# EAGLE board STUSB4500_PS (EAGLE 9.5.2), part 1 of 2
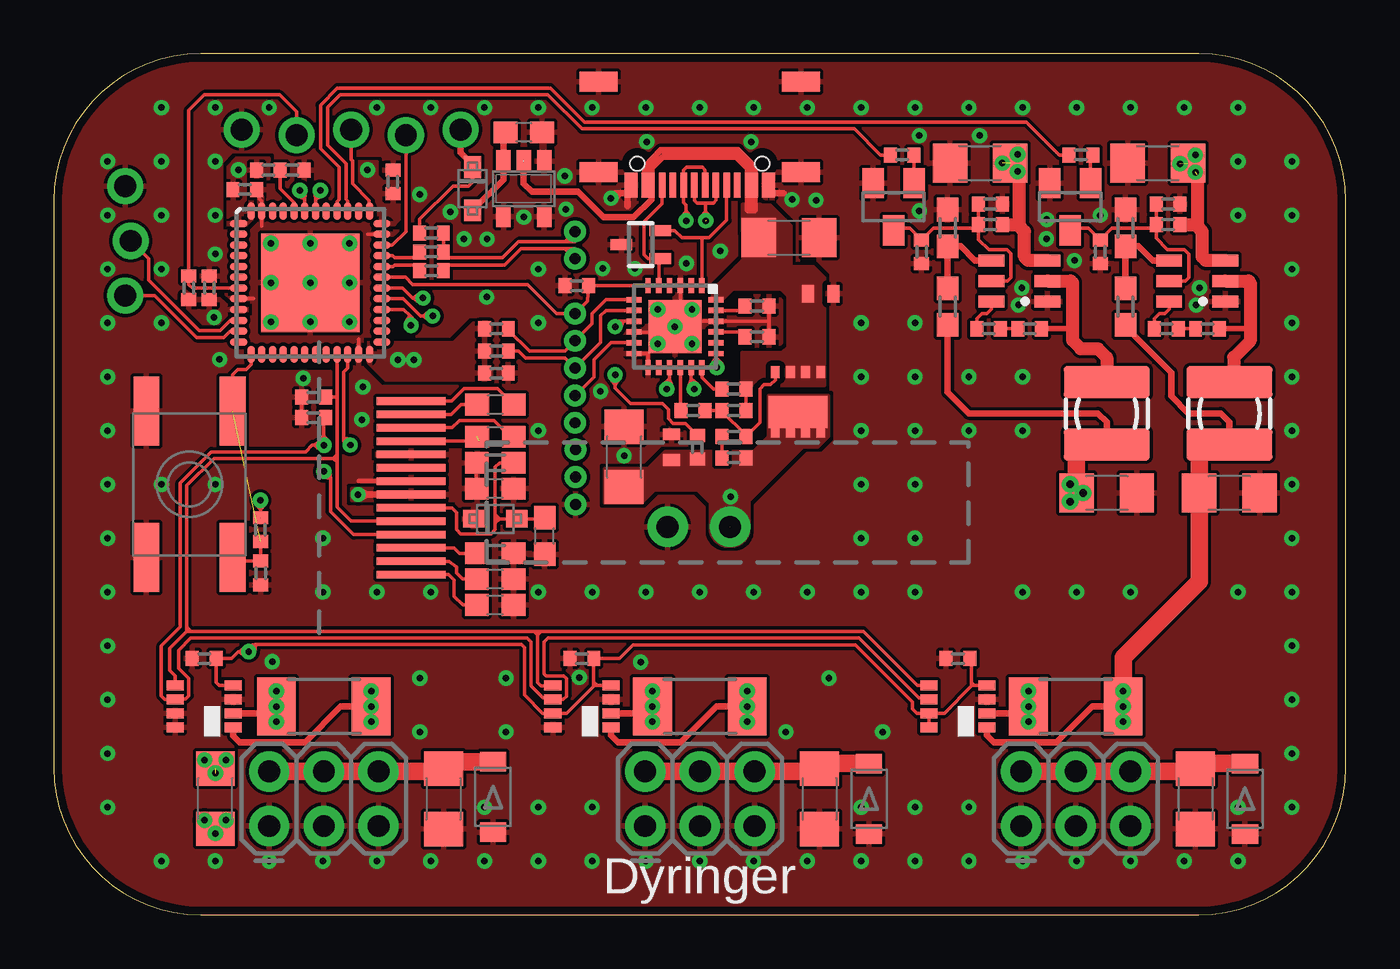
[diagram p4: board, top side]
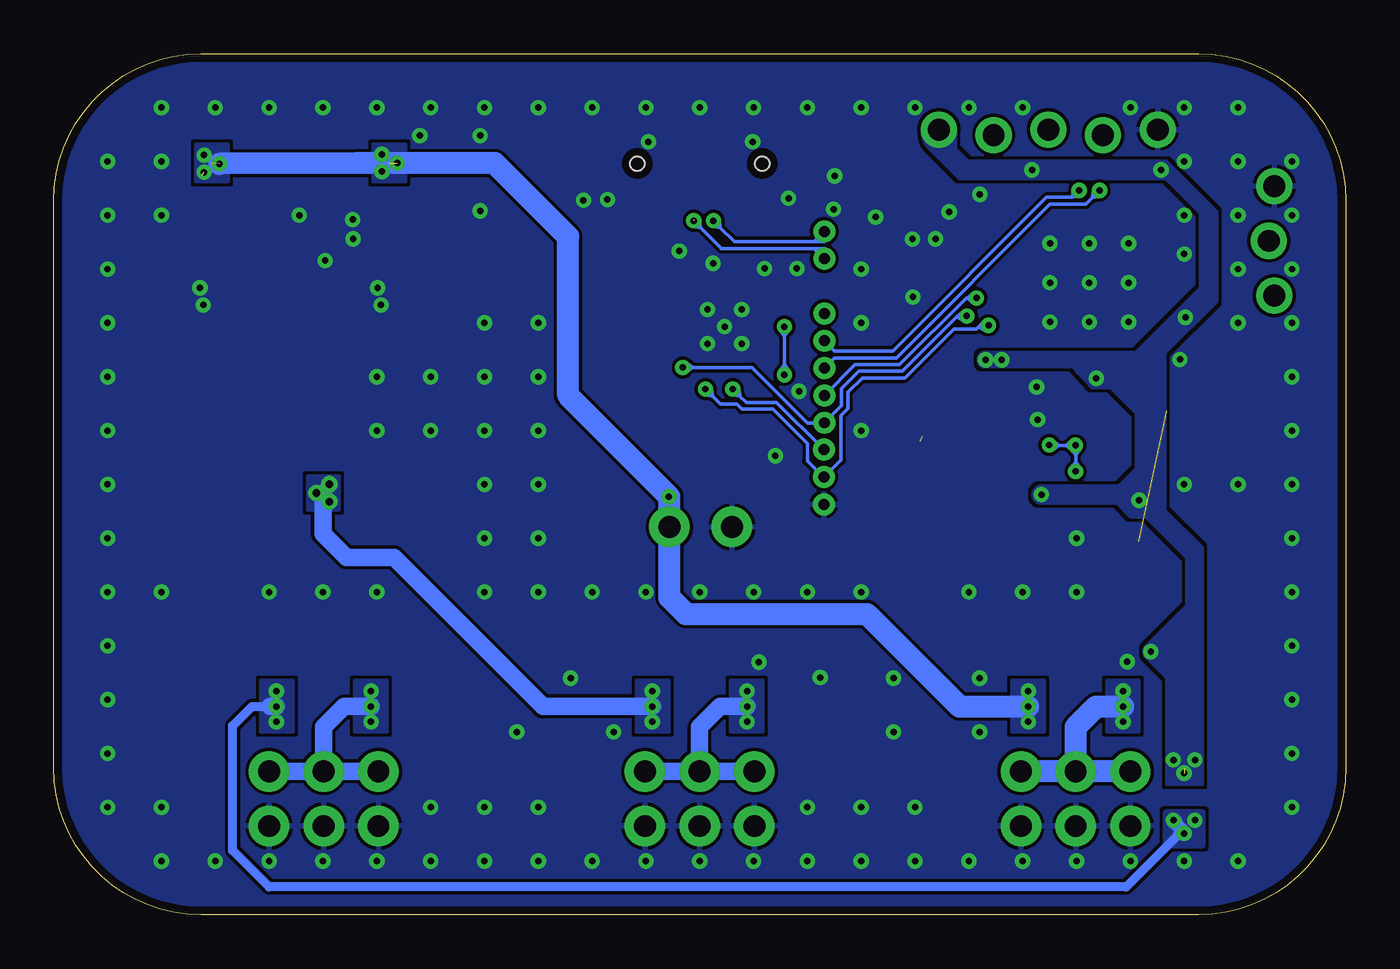
[diagram p5: board, bottom side, seen from below]

Size 60 x 40 mm. Coordinates in mm from the lower left corner, seen from the top.
Outline: 0,33.17 0,6.83 arc90 6.83,0 53.17,0 arc90 60,6.83 60,33.17 arc90 53.17,40 6.83,40 arc90 0,33.17
Copper layers (1*16): Top 0.035mm / dielectric 0.15mm / Bottom 0.035mm
Design rules "default *": minimum track width 6mil, minimum drill 0.3mm, track to track 6mil, track to pad 6mil, pad to pad 6mil, via to via 6mil, smd to smd 6mil, copper to edge 15mil, drill to drill 6mil, minimum pad ring 10mil, minimum via ring 8mil, stop-mask expansion 3mil, vias tented up to drill 20mil, thermal gap 6mil

## Footprints (pad centres in the part's own frame; a part is rotated, then mirrored left to right if it is on the bottom)
C0603 = smd 1.1 x 1: 1 -0.85,0; 2 0.85,0
C0402 = smd 0.6 x 0.7: 1 -0.55,0; 2 0.55,0
C1206 = smd 1.6 x 1.8: 1 -1.4,0; 2 1.4,0
SOD-123FL = smd 0.91 x 1.22: A 1.637,0; C -1.637,0
SOD-323F = smd 1 x 0.8: A -1,0; C 1,0
SOT323 = smd 0.5 x 1: 1 0,0.9; 2 -0.65,-0.9; 3 0.65,-0.9
1206 = smd 1.6 x 1.8: 1 -1.4,0; 2 1.4,0
1X05_LOCK = drill 1.016 pad 1.676: 1 0,0.127; 2 2.54,-0.127; 3 5.08,0.127; 4 7.62,-0.127; 5 10.16,0.127
2X3-NS = drill 1.016 pad 1.88: 1 -2.54,-1.27; 2 -2.54,1.27; 3 0,-1.27; 4 0,1.27; 5 2.54,-1.27; 6 2.54,1.27
1X03_LOCK_NO_SILK = drill 1.016 pad 1.676: 1 0,0.127; 2 2.54,-0.127; 3 5.08,0.127
1X02_LOCK = drill 1.016 pad 1.88: 1 -0.178,0; 2 2.718,0
1X05_1.27MM = drill 0.508 pad 1: 1 0,0; 2 1.27,0; 3 2.54,0; 4 3.81,0; 5 5.08,0
1X02_1.27MM = drill 0.508 pad 1: 1 0,0; 2 1.27,0
1X03_1.27MM = drill 0.508 pad 1: 1 0,0; 2 1.27,0; 3 2.54,0
POWER-CHOKE_WE-TPC = smd 4 x 1.5: 1 0,1.45; 2 0,-1.45
UG-2832HSWEG02_WRAPUNDER = smd 3.2 x 0.35: 1 2.03,4.03; 2 2.03,3.41; 3 2.03,2.79; 4 2.03,2.17; 5 2.03,1.55; 6 2.03,0.93; 7 2.03,0.31; 8 2.03,-0.31; 9 2.03,-0.93; 10 2.03,-1.55; 11 2.03,-2.17; 12 2.03,-2.79; 13 2.03,-3.41; 14 2.03,-4.03
R0402 = smd 0.6 x 0.7: 1 -0.55,0; 2 0.55,0
R2010 = smd 1.8 x 2.7: 1 -2.2,0; 2 2.2,0
R0603 = smd 1.1 x 1: 1 -0.85,0; 2 0.85,0
EVQ-Q2 = smd 3.2 x 1.2: A -3.4,-2; A' 3.4,-2; B -3.4,2; B' 3.4,2
SOT23 = smd 1 x 1.4: 1 -0.95,-1.1; 2 0.95,-1.1; 3 0,1.1
SOT23-5 = smd 0.69 x 0.99: 1 -0.95,-1.29; 2 0,-1.29; 3 0.95,-1.29; 4 0.95,1.3; 5 -0.95,1.3
QFN24-4X4 = smd 0.7 x 0.25: 1 -1.9,1.25; 2 -1.9,0.75; 3 -1.9,0.25; 4 -1.9,-0.25; 5 -1.9,-0.75; 6 -1.9,-1.25; 13 1.9,-1.25; 14 1.9,-0.75; 15 1.9,-0.25; 16 1.9,0.25; 17 1.9,0.75; 18 1.9,1.25 | smd 0.25 x 0.7: 7 -1.25,-1.9; 8 -0.75,-1.9; 9 -0.25,-1.9; 10 0.25,-1.9; 11 0.75,-1.9; 12 1.25,-1.9; 19 1.25,1.9; 20 0.75,1.9; 21 0.25,1.9; 22 -0.25,1.9; 23 -0.75,1.9; 24 -1.25,1.9 | smd 2.45 x 2.45: EXP 0,0
DCN-R-PDSO-G8 = smd 0.45 x 0.8: 1 -0.975,-1.35; 2 -0.325,-1.35; 3 0.325,-1.35; 4 0.975,-1.35; 5 0.975,1.35; 6 0.325,1.35; 7 -0.325,1.35; 8 -0.975,1.35
P-HVQFN48-7X7 = smd 0.8 x 0.35: 1 -3.325,2.75; 2 -3.325,2.25; 3 -3.325,1.75; 4 -3.325,1.25; 5 -3.325,0.75; 6 -3.325,0.25; 7 -3.325,-0.25; 8 -3.325,-0.75; 9 -3.325,-1.25; 10 -3.325,-1.75; 11 -3.325,-2.25; 12 -3.325,-2.75; 25 3.325,-2.75; 26 3.325,-2.25; 27 3.325,-1.75; 28 3.325,-1.25; 29 3.325,-0.75; 30 3.325,-0.25; 31 3.325,0.25; 32 3.325,0.75; 33 3.325,1.25; 34 3.325,1.75; 35 3.325,2.25; 36 3.325,2.75 | smd 0.35 x 0.8: 13 -2.75,-3.325; 14 -2.25,-3.325; 15 -1.75,-3.325; 16 -1.25,-3.325; 17 -0.75,-3.325; 18 -0.25,-3.325; 19 0.25,-3.325; 20 0.75,-3.325; 21 1.25,-3.325; 22 1.75,-3.325; 23 2.25,-3.325; 24 2.75,-3.325; 37 2.75,3.325; 38 2.25,3.325; 39 1.75,3.325; 40 1.25,3.325; 41 0.75,3.325; 42 0.25,3.325; 43 -0.25,3.325; 44 -0.75,3.325; 45 -1.25,3.325; 46 -1.75,3.325; 47 -2.25,3.325; 48 -2.75,3.325 | smd 4.572 x 4.572: _ 0,0
TEXAS_SOT23-6 = smd 0.55 x 1.2: 1 -0.95,-1.3; 2 0,-1.3; 3 0.95,-1.3; 4 0.95,1.3; 5 0,1.3; 6 -0.95,1.3
USB-C_16P = smd 0.3 x 1.15: A1 -3.35,0.6; A4 -2.55,0.6; A5 -1.25,0.6; A6 -0.25,0.6; A7 0.25,0.6; A8 1.25,0.6; A9 2.55,0.6; A12 3.35,0.6; B1 3.05,0.6; B4 2.25,0.6; B5 1.75,0.6; B6 0.75,0.6; B7 -0.75,0.6; B8 -1.75,0.6; B9 -2.25,0.6; B12 -3.05,0.6 | smd 1.778 x 0.914: P$1 -4.7,-4.2; P$2 -4.7,0; P$3 4.7,0; P$4 4.7,-4.2 | hole 0.65: -2.9,-0.4; 2.9,-0.4
1610 = smd 0.55 x 0.8: P$1 0.596,0; P$2 -0.596,0
POWER_FLAT_3X3 = smd 0.4 x 0.55: P$1 -1.05,-0.95; P$2 -0.35,-0.95; P$3 0.35,-0.95; P$4 1.05,-0.95; P$5 -1.05,1.8; P$6 -0.35,1.8; P$7 0.35,1.8; P$8 1.05,1.8 | smd 2.75 x 1.47: P$9 0,0.9

## Placement (x,y rotation side)
C1  10uF 6.3V  [C0603]  21.83,36.35 180 top
C2  100nF 25V  [C0402]  40.3,30.8 90 top
C3  100nF 25V  [C0402]  48.6,30.8 90 top
C4  10uF 6.3V  [C0603]  22.8,17.6 90 top
C6  100nF 25V  [C0402]  24.53,11.91 180 top
C7  100nF 25V  [C0402]  41.99,11.91 180 top
C8  100nF 25V  [C0402]  6.99,11.91 180 top
C9  100nF 25V  [C0402]  45.32,27.23 0 top
C10  22uF 6.3V  [C1206]  48.9,19.6 180 top
C11  10uF 25V  [C1206]  43.02,34.92 0 top
C12  100nF 25V  [C0402]  53.58,27.23 0 top
C13  22uF 6.3V  [C1206]  54.6,19.6 180 top
C14  10uF 25V  [C1206]  51.28,34.92 0 top
C15  100nF 25V  [C0402]  8.87,33.69 0 top
C16  100nF 25V  [C0402]  15.75,34.05 90 top
C17  100nF 25V  [C0402]  20.56,25.16 0 top
C18  100nF 25V  [C0402]  9.61,15.88 90 top
C19  100nF 25V  [C0402]  7.22,29.13 90 top
C20  10uF 6.3V  [C0603]  20.5,14.4 180 top
C21  10uF 6.3V  [C0603]  20.5,15.6 180 top
C22  1uF 25V  [C0603]  20.5,19.8 180 top
C23  1uF 25V  [C0603]  20.51,22.22 0 top
C24  1uF 25V  [C0603]  20.51,23.71 0 top
C25  22uF 6.3V  [C1206]  35.56,5.4 270 top
C26  22uF 6.3V  [C1206]  53.02,5.4 270 top
C27  10uF 25V  [C1206]  18.1,5.4 270 top
C28  1uF 6.3V  [C0402]  32.66,28.28 0 top
C29  1uF 6.3V  [C0402]  32.66,26.85 0 top
C30  100nF 25V  [C0402]  31.59,21.23 0 top
C31  10uF 25V  [C1206]  34.14,31.46 0 top
C32  10uF 25V  [C1206]  26.49,21.28 90 top
D1  [SOD-123FL]  20.4,5.48 270 top
D2  1N4148  [SOD-323F]  20.5,18.4 180 top
D3  [SOD-123FL]  55.32,5.4 270 top
D4  [SOD-123FL]  37.86,5.4 270 top
D5  1N4148  [SOD-323F]  19.45,33.73 90 top
ESDA25W1  ESDA25WSOT323  [SOT323]  27.26,31.14 90 top
F1  6V/0.5A  [1206]  7.5,5.4 90 top
J1  [1X05_LOCK]  8.73,36.35 0 top
J2  FEMALE 2x3  [2X3-NS]  30,5.4 0 top
J3  FEMALE 2x3  [2X3-NS]  47.47,5.4 0 top
J4  FEMALE 2x3  [2X3-NS]  12.54,5.4 0 top
J9  [1X03_LOCK_NO_SILK]  3.45,28.77 90 top
J10  [1X02_LOCK]  31.23,18.03 180 top
J11  [1X05_1.27MM]  24.21,27.94 270 top
J12  [1X02_1.27MM]  24.21,31.75 270 top
J13  [1X03_1.27MM]  24.24,21.61 270 top
L1  5.6uH  [POWER-CHOKE_WE-TPC]  48.9,23.3 0 top
L2  4.7uH  [POWER-CHOKE_WE-TPC]  54.6,23.3 0 top
LCD2  [UG-2832HSWEG02_WRAPUNDER]  14.57,19.84 0 top
R1  1k  [R0402]  6.27,29.13 270 top
R2  [R0402]  47.7,35.3 180 top
R3  [R0402]  39.4,35.3 180 top
R8  0.1R  [R2010]  30,9.68 0 top
R11  30  [R0402]  43.42,27.23 0 top
R12  52.3k  [R0603]  41.51,28.26 270 top
R14  0.1R  [R2010]  47.47,9.68 0 top
R15  10k  [R0603]  41.51,31.91 270 top
R16  [R0402]  43.5,32.07 0 top
R19  0.1R  [R2010]  12.54,9.68 0 top
R22  [R0402]  43.5,33.02 180 top
R23  30  [R0402]  51.67,27.23 0 top
R24  31.6k  [R0603]  49.77,28.26 270 top
R25  10k  [R0603]  49.77,31.91 270 top
R26  [R0402]  51.75,32.07 0 top
R27  [R0402]  51.75,33.02 180 top
R28  56  [R0402]  17.54,29.92 0 top
R29  56  [R0402]  17.54,30.8 0 top
R30  390K  [R0603]  20.5,16.8 180 top
R31  10k  [R0603]  20.5,21 180 top
R32  1k  [R0402]  24.29,29.23 0 top
R33  10k  [R0402]  12.06,24.05 180 top
R34  10k  [R0402]  12.06,23.1 180 top
R35  10k  [R0402]  9.6,17.9 90 top
R37  10k  [R0402]  20.56,27.23 180 top
R38  10k  [R0402]  20.56,26.19 180 top
R39  1k  [R0402]  11.07,34.59 180 top
R40  1k  [R0402]  9.97,34.6 180 top
R41  100k  [R0402]  31.59,23.43 0 top
R42  22k  [R0402]  29.69,23.43 0 top
R43  100  [R0402]  31.59,22.23 0 top
R44  1k  [R0402]  31.59,24.43 180 top
R45  1k  [R0402]  29.89,21.73 90 top
R55  1.5k  [R0402]  17.54,31.67 180 top
SW1  SPST_TACT-EVQQ2  [EVQ-Q2]  6.3,20 270 top
T1  BC847  [SOT23]  47.2,32.9 180 top
T2  BC847  [SOT23]  39,32.9 180 top
U$1  TLV704_3V3SOT23-5  [SOT23-5]  21.83,33.73 180 top
U$3  STUSB4500QFN24_4X4  [QFN24-4X4]  28.85,27.33 270 top
U$7  INA219DCN  [DCN-R-PDSO-G8]  24.53,9.68 90 top
U$8  STM32F072QFN48  [P-HVQFN48-7X7]  11.91,29.37 0 top
U$9  INA219DCN  [DCN-R-PDSO-G8]  41.99,9.68 90 top
U$10  INA219DCN  [DCN-R-PDSO-G8]  6.99,9.68 90 top
U$11  TPS56339SOT23-6  [TEXAS_SOT23-6]  44.85,29.45 90 top
U$12  TPS56339SOT23-6  [TEXAS_SOT23-6]  53.1,29.45 90 top
U$13  USB-C  [USB-C_16P]  30,34.5 180 top
U$14  ESDA25P35  [1610]  35.61,28.85 0 top
U$15  ESDA25P35  [1610]  28.69,21.73 90 top
U$16  STL6P3LLH6  [POWER_FLAT_3X3]  34.56,24.26 180 top